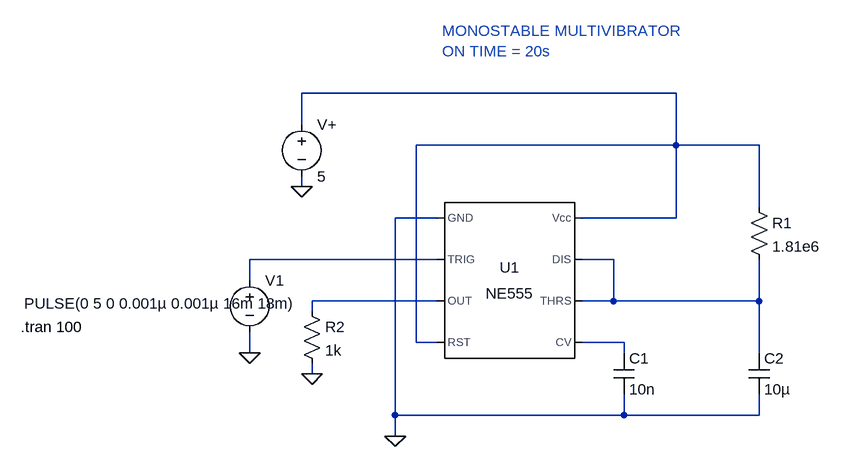
[diagram p0: schematic monostable_multivibrator.asc]
monostable_multivibrator.asc, the LTspice schematic file:
Version 4
SHEET 1 904 680
WIRE 640 -112 64 -112
WIRE 64 -64 64 -112
WIRE 640 -32 640 -112
WIRE 640 -32 240 -32
WIRE 768 -32 640 -32
WIRE 64 32 64 16
WIRE 768 64 768 -32
WIRE 272 80 208 80
WIRE 640 80 640 -32
WIRE 640 80 496 80
WIRE 272 144 -16 144
WIRE 544 144 496 144
WIRE -16 176 -16 144
WIRE 272 208 80 208
WIRE 544 208 544 144
WIRE 544 208 496 208
WIRE 768 208 768 144
WIRE 768 208 544 208
WIRE 80 224 80 208
WIRE 240 272 240 -32
WIRE 272 272 240 272
WIRE 560 272 496 272
WIRE -16 288 -16 256
WIRE 560 288 560 272
WIRE 768 288 768 208
WIRE 80 320 80 304
WIRE 208 384 208 80
WIRE 560 384 560 352
WIRE 560 384 208 384
WIRE 768 384 768 352
WIRE 768 384 560 384
WIRE 208 416 208 384
FLAG -16 288 0
FLAG 80 320 0
FLAG 64 32 0
FLAG 208 416 0
SYMBOL Misc\\NE555 384 176 R0
SYMATTR InstName U1
SYMBOL res 64 208 R0
SYMATTR InstName R2
SYMATTR Value 1k
SYMBOL voltage -16 160 R0
WINDOW 3 -347 52 Left 2
WINDOW 123 0 0 Left 0
WINDOW 39 0 0 Left 0
SYMATTR Value PULSE(0 5 0 0.001µ 0.001µ 16m 18m)
SYMATTR InstName V1
SYMBOL voltage 64 -80 R0
WINDOW 123 0 0 Left 0
WINDOW 39 0 0 Left 0
SYMATTR InstName V+
SYMATTR Value 5
SYMBOL cap 544 288 R0
SYMATTR InstName C1
SYMATTR Value 10n
SYMBOL cap 752 288 R0
SYMATTR InstName C2
SYMATTR Value 10µ
SYMBOL res 752 48 R0
SYMATTR InstName R1
SYMATTR Value 1.81e6
TEXT -368 248 Left 2 !.tran 100
TEXT 280 -208 Left 2 ;MONOSTABLE MULTIVIBRATOR\nON TIME = 20s

The netlist it stands for:
* monostable_multivibrator.asc
XU1 0 N002 N004 N001 N005 N003 N003 N001 NE555  ; pins GND TRIG OUT RST CV THRS DIS Vcc
R2 N004 0 1k
V1 N002 0 PULSE(0 5 0 0.001µ 0.001µ 16m 18m)
V+ N001 0 5
C1 N005 0 10n
C2 N003 0 10µ
R1 N001 N003 1.81e6
.tran 100
* MONOSTABLE MULTIVIBRATOR
* ON TIME = 20s
.lib NE555.sub
.backanno
.end